# Altium schematic sheet Sheet1.SchDoc
size Letter; SheetNumber: 1; SheetTotal: 1
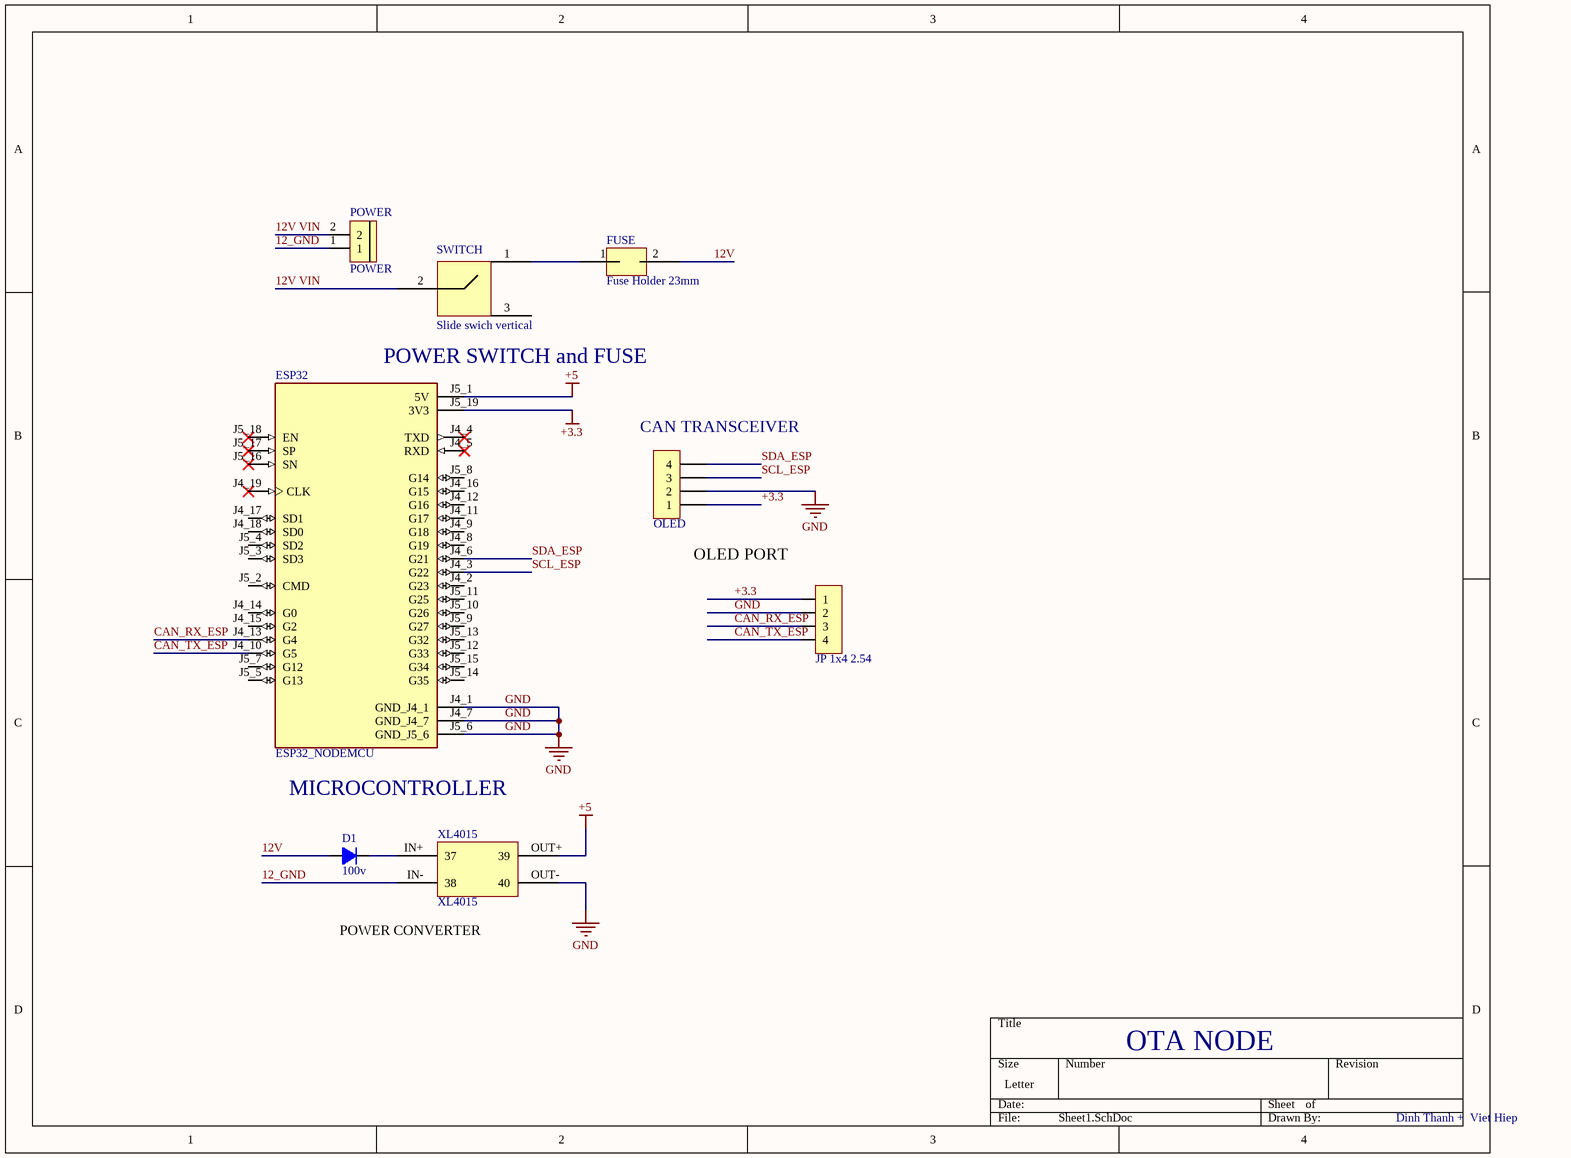
[diagram p0: Sheet1.SchDoc]

## Parts
CAN  JP 1x4 2.54  [JP 1x4 CC]
D1  100v  [DIODE 1A]
ESP32  ESP32_NODEMCU  [ESP32 SMALL]
FUSE  Fuse Holder 23mm  [Fuse3]
OLED  OLED  [XH2.54M-4]
POWER  POWER  [Con 2 KF301 5.08]
SWITCH  Slide swich vertical  [SW102T]
XL4015  XL4015  [XL4015]

## Nets
+3.3: CAN.1 ESP32.J5_19(3V3) OLED.1
+5: ESP32.J5_1(5V) XL4015.OUT+(39)
GND: CAN.2 ESP32.J4_1(GND_J4_1) ESP32.J4_7(GND_J4_7) ESP32.J5_6(GND_J5_6) OLED.2 XL4015.OUT-(40)
12_GND: POWER.1 XL4015.IN-(38)
12V: D1.1(A) FUSE.2
12V VIN: POWER.2 SWITCH.2
CAN_RX_ESP: CAN.3 ESP32.J4_13(G4)
CAN_TX_ESP: CAN.4 ESP32.J4_10(G5)
SCL_ESP: ESP32.J4_3(G22) OLED.3
SDA_ESP: ESP32.J4_6(G21) OLED.4
NetD1_2: D1.2(K) XL4015.IN+(37)
NetFUSE_1: FUSE.1 SWITCH.1

Not connected (* = marked no-connect by the designer): ESP32 J4_2(G23) J4_4(TXD)* J4_5(RXD)* J4_8(G19) J4_9(G18) J4_11(G17) J4_12(G16) J4_14(G0) J4_15(G2) J4_16(G15) J4_17(SD1) J4_18(SD0) J4_19(CLK)* J5_2(CMD) J5_3(SD3) J5_4(SD2) J5_5(G13) J5_7(G12) J5_8(G14) J5_9(G27) J5_10(G26) J5_11(G25) J5_12(G33) J5_13(G32) J5_14(G35) J5_15(G34) J5_16(SN)* J5_17(SP)* J5_18(EN)*; SWITCH 3(43)

## Notes on the sheet
- POWER SWITCH and FUSE
- (near OLED) CAN TRANSCEIVER
- OLED PORT
- MICROCONTROLLER
- (near XL4015) POWER CONVERTER
- OTA NODE
- Dinh Thanh +  Viet Hiep

## Library data of the parts
CAN = JP 1x4 2.54 Cai Cong: Cắm; Ten_Linh_Kien: Jump Đơn Cái 2.54MM 1x40P Cong; Don_Vi: Con; Ma_Hang: MH001265; Ghi_Chu: *; Kieu_Chan: *; Chung_Loai: Cắm
D1 = Diode 1N4007: Cắm; Ten_Linh_Kien: Diode 1N4007 1A (DIP); Don_Vi: Con; Ma_Hang: MH001063; Ghi Chu: *; Kieu_Chan: *; Chung_Loai: Cắm
ESP32 = ESP32_NODEMCU: NodeMCU is an open source loT platform. ESP32 is a series of low cost, low powersystem-on-chip (SoC) microcontrollers with integrated Wi-Fi & dual-mode Bluetooth.; MF: Espressif Systems; MP: ESP32 NODEMCU; SnapEDA_Link: https://www.snapeda.com/parts/ESP32%20NODEMCU/Espressif+Systems/view-part/?ref=snap; Package: Package; Value: *; Check_prices: https://www.snapeda.com/parts/ESP32%20NODEMCU/Espressif+Systems/view-part/?ref=eda
OLED = Header 4P 2.54 Duc Thang: Cắm; Ten_Linh_Kien: Header 4P XH2.54-4P Đực Thẳng; Don_Vi: Con; Ma_Hang: MH001285; Chung_Loai: Cắm
POWER = CON 2 KF301: Cắm; Ma_Hang: MH000987; Ten_Linh_Kien: CON 2 KF301-2P 5.08MM Xanh Dương; Don_Vi: Con; Chung_Loai: Cắm; Ghi_Chu: *; Kieu_Chan: *